# Altium schematic sheet CurrentSense.SchDoc
size A4; DocumentNumber: 12; SheetNumber: 14; SheetTotal: 15
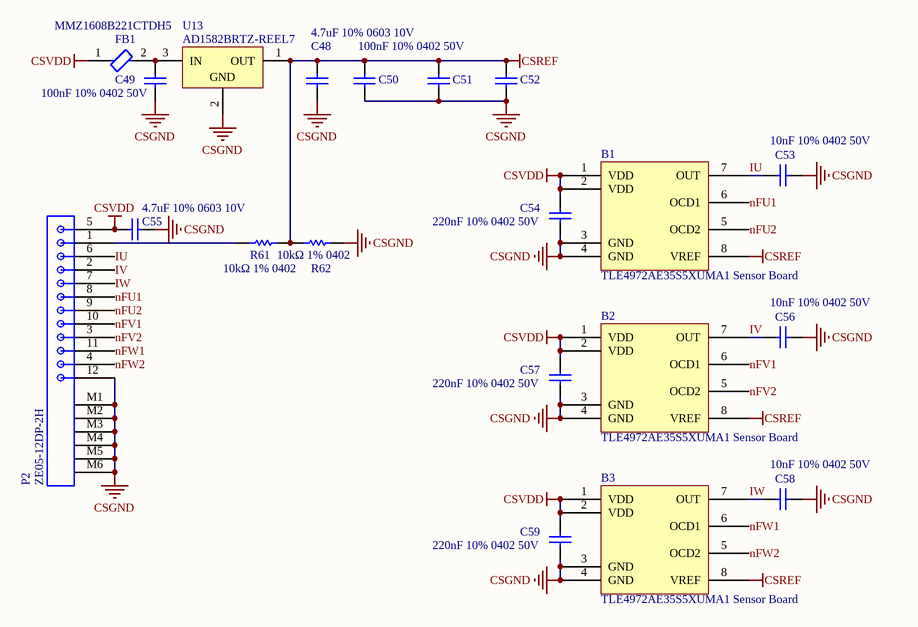
[diagram p0: CurrentSense.SchDoc]

## Parts
B1  TLE4972AE35S5XUMA1 Sensor Board  [TLE4972AE35S5XUMA1 Sensor Board-Footprint-1]
B2  TLE4972AE35S5XUMA1 Sensor Board  [TLE4972AE35S5XUMA1 Sensor Board-Footprint-1]
B3  TLE4972AE35S5XUMA1 Sensor Board  [TLE4972AE35S5XUMA1 Sensor Board-Footprint-1]
C48  4.7uF 10% 0603 10V  [0603L]
C49  100nF 10% 0402 50V  [0402N]
C50  100nF 10% 0402 50V  [0402N]
C51  100nF 10% 0402 50V  [0402N]  (value not drawn)
C52  100nF 10% 0402 50V  [0402N]  (value not drawn)
C53  10nF 10% 0402 50V  [0402N]
C54  220nF 10% 0402 50V  [0402N]
C55  4.7uF 10% 0603 10V  [0603L]
C56  10nF 10% 0402 50V  [0402N]
C57  220nF 10% 0402 50V  [0402N]
C58  10nF 10% 0402 50V  [0402N]
C59  220nF 10% 0402 50V  [0402N]
FB1  MMZ1608B221CTDH5  [FP-MMZ1608-0_6-MFG]
P2  ZE05-12DP-2H  [ZE05-12DP-2H-Footprint-1]
R61  10kΩ 1% 0402  [0402N]
R62  10kΩ 1% 0402  [0402N]
U13  AD1582BRTZ-REEL7  [ADI-RT-3_M]

## Nets
CSGND: B1.3(GND) B1.4(GND) B2.3(GND) B2.4(GND) B3.3(GND) B3.4(GND) C48.1 C49.1 C50.1 C51.1 C52.1 C53.1 C54.1 C55.1 C56.1 C57.1 C58.1 C59.1 P2.12 P2.M1 P2.M2 P2.M3 P2.M4 P2.M5 P2.M6 R62.2 U13.2(GND)
CSREF: B1.8(VREF) B2.8(VREF) B3.8(VREF) C48.2 C50.2 C51.2 C52.2 R61.2 R62.1 U13.1(OUT)
CSVDD: B1.1(VDD) B1.2(VDD) B2.1(VDD) B2.2(VDD) B3.1(VDD) B3.2(VDD) C54.2 C55.2 C57.2 C59.2 FB1.1 P2.5
IU: B1.7(OUT) C53.2 P2.6
IV: B2.7(OUT) C56.2 P2.2
IW: B3.7(OUT) C58.2 P2.7
nFU1: B1.6(OCD1) P2.8
nFU2: B1.5(OCD2) P2.9
nFV1: B2.6(OCD1) P2.10
nFV2: B2.5(OCD2) P2.3
nFW1: B3.6(OCD1) P2.11
nFW2: B3.5(OCD2) P2.4
NetC49_2: C49.2 FB1.2 U13.3(IN)
NetP2_1: P2.1 R61.1

## Library data of the parts
B1-B3 = CMP-010-00024-1
C48 C55 = C0603: Capacitance: 4.7u; Tolerance: 10; Voltage: 10; Footprint: 0603
C49-C52 = C0402: Capacitance: 100n; Tolerance: 10; Voltage: 50; Footprint: 0402
C53 C56 C58 = C0402: Capacitance: 10n; Tolerance: 10; Voltage: 50; Footprint: 0402
C54 C57 C59 = C0402: Capacitance: 220n; Tolerance: 10; Voltage: 50; Footprint: 0402
FB1 = CMP-08257-000361-1: Signal Line Ferrite Bead 220 Ω 100MHz 500mA DCR 250mΩ AEC-Q200 SMD 0603; DC Resistance (DCR): 250mR; Tolerance: 25%; Number of Lines: 1; Impedance: 220R; Case Code (Metric): 1608; Package Quantity: 4000; Case Code (Imperial): 0603; Max DC Current: 500mA; Mount: Surface Mount; Ratings: AEC-Q200; Test Frequency: 100MHz; RoHS Compliant: Yes; Min Operating Temperature: -55°C; Height: 0.03inch; Packaging: Tape and Reel; Weight: 7.1E-05oz; Max Current Rating: 500mA; Case/Package: 0603; Width: 0.031inch; Termination: SMD/SMT; Max Operating Temperature: 125°C; Length: 0.063inch
P2 = CMP-002-00109-1: High Heat and Vibration Resistance, 05 Size, 2mm pitch Automotive Interface Connector, -40 to 125 ℃, RoHS; RoHS Compliant: Yes
R61 R62 = R0402: Resistance: 10k; Tolerance: 1; Footprint: 0402
U13 = CMP-0784-00464-1: Micropower, Precision Series Mode Voltage Reference, 2.5 V Output, 2.7 to 12 V Supply, Industrial, 3-pin SOT23 (RT-3), Reel; Manufacturer: Analog Devices; Vout: 2.5V; Ref Out TC (ppm/C): 18; ComponentLink2URL: http://www.analog.com/static/imported-files/data_sheets/AD1582_1583_1584_1585.pdf; DatasheetVersion: Rev. I; Mounting Technology: Surface Mount; Packing: Reel; PackageDescription: 3-Pin Small Outline Transistor Package, Body 2.9 x 1.3 mm, Pitch 0.96 mm; ComponentLink3Description: Package Specification; PackageVersion: 011909-C, 02/2009; ComponentLink4Description: URL Link1; PackageReference: RT-3; ComponentLink1URL: http://www.analog.com/en/index.html; PartNumber: AD1582BRTZ-REEL7; ComponentLink1Description: Manufacturer URL; ComponentLink2Description: Datasheet; ComponentLink4URL: Product URL:http://www.analog.com/en/special-linear-functions/voltage-references/ad1582/products/product.html; Operating Temp Range: -40 to 125 degC; Code_JEDEC: TO-236-AB; ComponentLink3URL: http:/www.analog.com/static/imported-files/packages/PKG_PDF/SOT-23-3 (RT)/RT_3.pdf